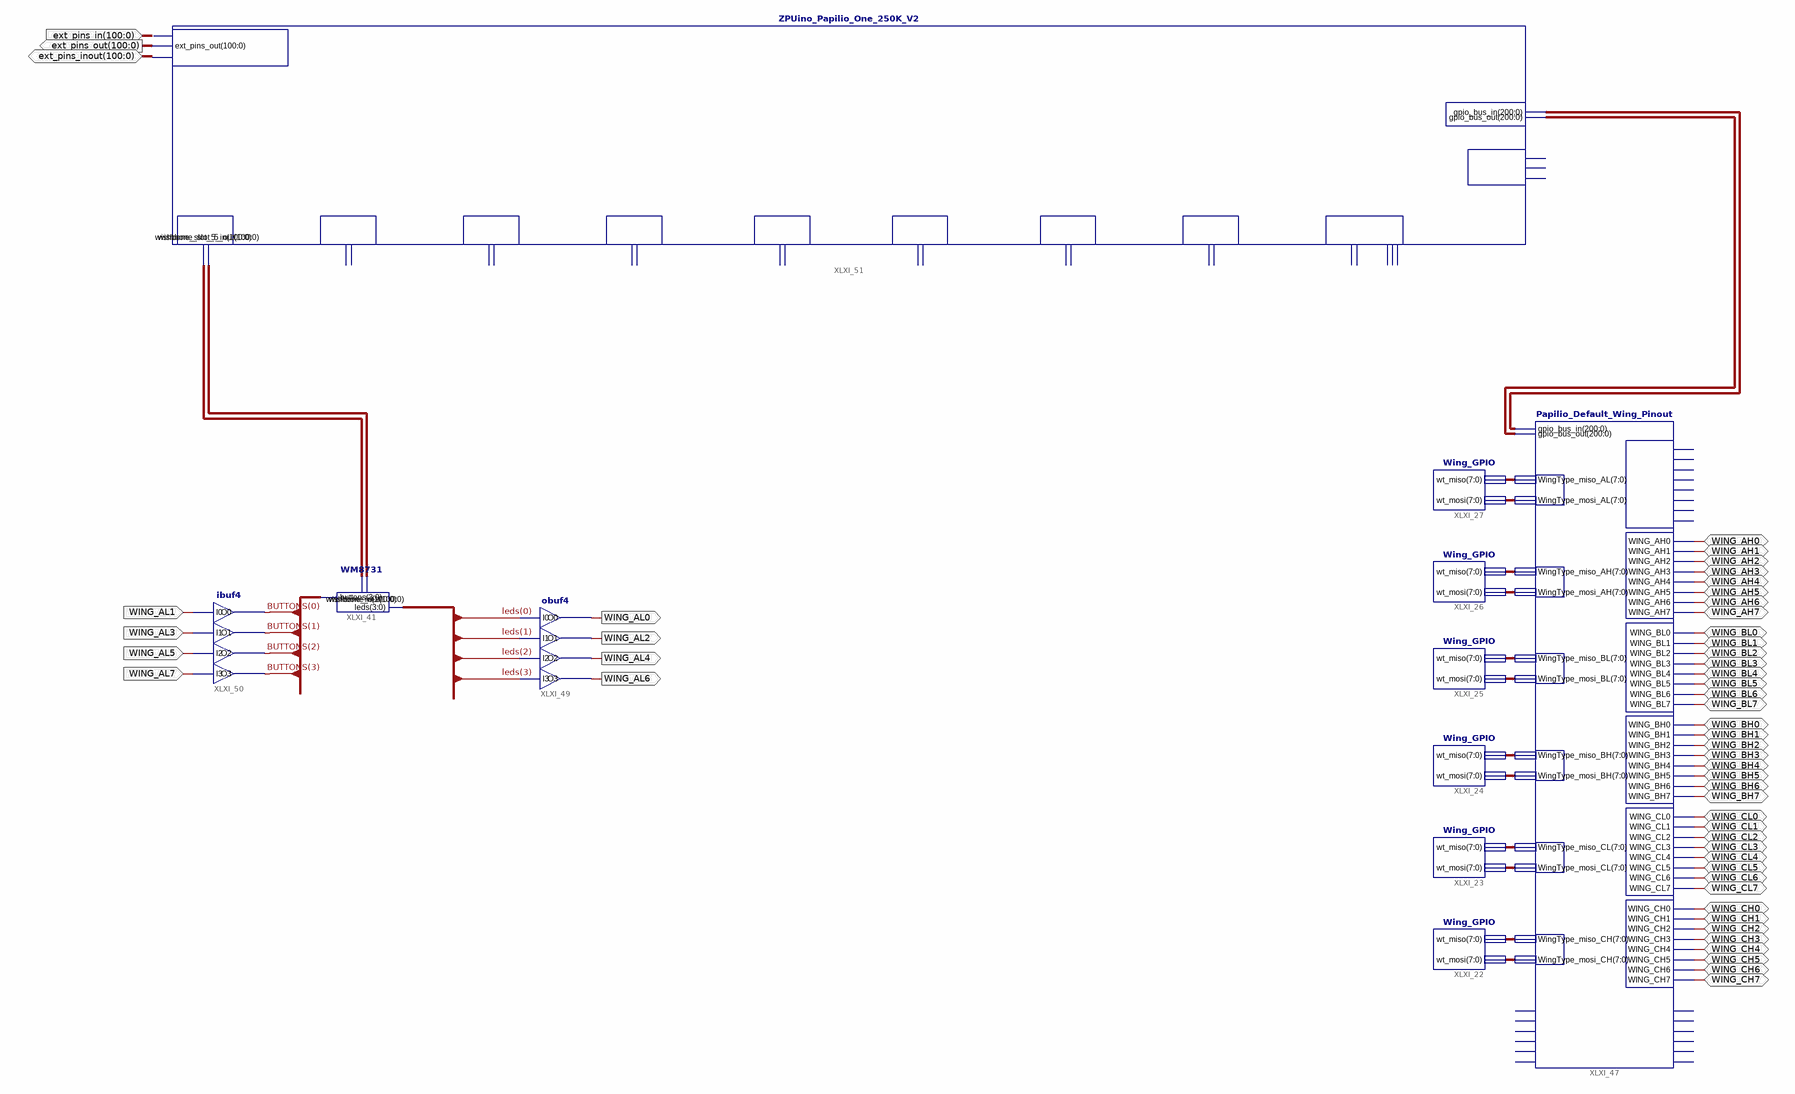
[diagram p0: schematic sheet 1]
// Xilinx ISE schematic Papilio_One_250K.sch (spartan3e) as structural Verilog: 11 symbols, 51 ports
module Papilio_One_250K (
  input  [100:0] ext_pins_in,
  input  WING_AL1,
  input  WING_AL3,
  input  WING_AL5,
  input  WING_AL7,
  inout  WING_AH0,
  inout  WING_AH1,
  inout  WING_AH2,
  inout  WING_AH3,
  inout  WING_AH4,
  inout  WING_AH5,
  inout  WING_AH6,
  inout  WING_AH7,
  inout  WING_BL0,
  inout  WING_BL1,
  inout  WING_BL2,
  inout  WING_BL3,
  inout  WING_BL4,
  inout  WING_BL5,
  inout  WING_BL6,
  inout  WING_BL7,
  inout  WING_BH0,
  inout  WING_BH1,
  inout  WING_BH2,
  inout  WING_BH3,
  inout  WING_BH4,
  inout  WING_BH5,
  inout  WING_BH6,
  inout  WING_BH7,
  inout  WING_CL0,
  inout  WING_CL1,
  inout  WING_CL2,
  inout  WING_CL3,
  inout  WING_CL4,
  inout  WING_CL5,
  inout  WING_CL6,
  inout  WING_CL7,
  inout  WING_CH0,
  inout  WING_CH1,
  inout  WING_CH2,
  inout  WING_CH3,
  inout  WING_CH4,
  inout  WING_CH5,
  inout  WING_CH6,
  inout  WING_CH7,
  inout  [100:0] ext_pins_inout,
  output [100:0] ext_pins_out,
  output WING_AL0,
  output WING_AL2,
  output WING_AL4,
  output WING_AL6
);

  wire [3:0] BUTTONS, leds;
  wire [7:0] XLXN_325, XLXN_326, XLXN_327, XLXN_328, XLXN_329, XLXN_330, XLXN_331, XLXN_332, XLXN_333,
       XLXN_334, XLXN_335, XLXN_336;
  wire [100:0] XLXN_487, XLXN_488;
  wire [200:0] XLXN_408, XLXN_409;

  Papilio_Default_Wing_Pinout XLXI_47 (
    .WING_AH0(WING_AH0), .WING_AH1(WING_AH1), .WING_AH2(WING_AH2), .WING_AH3(WING_AH3), .WING_AH4(WING_AH4),
    .WING_AH5(WING_AH5), .WING_AH6(WING_AH6), .WING_AH7(WING_AH7), .WING_BH0(WING_BH0), .WING_BH1(WING_BH1),
    .WING_BH2(WING_BH2), .WING_BH3(WING_BH3), .WING_BH4(WING_BH4), .WING_BH5(WING_BH5), .WING_BH6(WING_BH6),
    .WING_BH7(WING_BH7), .WING_BL0(WING_BL0), .WING_BL1(WING_BL1), .WING_BL2(WING_BL2), .WING_BL3(WING_BL3),
    .WING_BL4(WING_BL4), .WING_BL5(WING_BL5), .WING_BL6(WING_BL6), .WING_BL7(WING_BL7), .WING_CL0(WING_CL0),
    .WING_CL1(WING_CL1), .WING_CL2(WING_CL2), .WING_CL3(WING_CL3), .WING_CL4(WING_CL4), .WING_CL5(WING_CL5),
    .WING_CL6(WING_CL6), .WING_CL7(WING_CL7), .WING_CH0(WING_CH0), .WING_CH1(WING_CH1), .WING_CH2(WING_CH2),
    .WING_CH3(WING_CH3), .WING_CH4(WING_CH4), .WING_CH5(WING_CH5), .WING_CH6(WING_CH6), .WING_CH7(WING_CH7),
    .gpio_bus_out(XLXN_408), .gpio_bus_in(XLXN_409), .WingType_miso_BH(XLXN_329),
    .WingType_miso_BL(XLXN_331), .WingType_miso_AH(XLXN_333), .WingType_mosi_BL(XLXN_332),
    .WingType_mosi_BH(XLXN_330), .WingType_mosi_CL(XLXN_328), .WingType_mosi_AH(XLXN_334),
    .WingType_miso_CL(XLXN_327), .WingType_miso_CH(XLXN_325), .WingType_mosi_CH(XLXN_326),
    .WingType_mosi_AL(XLXN_336), .WingType_miso_AL(XLXN_335));  // open: WING_AL0, WING_AL1, WING_AL2, WING_AL3, WING_AL4, WING_AL5, WING_AL6, WING_AL7, Flex_Pin_out_0, Flex_Pin_out_1, Flex_Pin_out_2, Flex_Pin_out_3, Flex_Pin_out_4, Flex_Pin_out_5, Flex_Pin_in_0, Flex_Pin_in_1, Flex_Pin_in_2, Flex_Pin_in_3, Flex_Pin_in_4, Flex_Pin_in_5
  Wing_GPIO XLXI_22 (.wt_miso(XLXN_325), .wt_mosi(XLXN_326));
  Wing_GPIO XLXI_23 (.wt_miso(XLXN_327), .wt_mosi(XLXN_328));
  Wing_GPIO XLXI_24 (.wt_miso(XLXN_329), .wt_mosi(XLXN_330));
  Wing_GPIO XLXI_25 (.wt_miso(XLXN_331), .wt_mosi(XLXN_332));
  Wing_GPIO XLXI_26 (.wt_miso(XLXN_333), .wt_mosi(XLXN_334));
  Wing_GPIO XLXI_27 (.wt_miso(XLXN_335), .wt_mosi(XLXN_336));
  WM8731 XLXI_41 (.buttons(BUTTONS), .leds(leds), .wishbone_in(XLXN_487), .wishbone_out(XLXN_488));
  obuf4 XLXI_49 (
    .I0(leds[0]), .I1(leds[1]), .I2(leds[2]), .I3(leds[3]), .O0(WING_AL0), .O1(WING_AL2), .O2(WING_AL4),
    .O3(WING_AL6));
  ibuf4 XLXI_50 (
    .I0(WING_AL1), .I1(WING_AL3), .I2(WING_AL5), .I3(WING_AL7), .O0(BUTTONS[0]), .O1(BUTTONS[1]),
    .O2(BUTTONS[2]), .O3(BUTTONS[3]));
  ZPUino_Papilio_One_250K_V2 XLXI_51 (
    .ext_pins_in(ext_pins_in), .ext_pins_out(ext_pins_out), .ext_pins_inout(ext_pins_inout),
    .gpio_bus_out(XLXN_408), .gpio_bus_in(XLXN_409), .wishbone_slot_5_out(XLXN_488),
    .wishbone_slot_5_in(XLXN_487));  // open: clk_96Mhz, clk_1Mhz, clk_osc_32Mhz, wishbone_slot_6_in, wishbone_slot_6_out, wishbone_slot_8_in, wishbone_slot_8_out, wishbone_slot_9_in, wishbone_slot_9_out, wishbone_slot_10_in, wishbone_slot_10_out, wishbone_slot_11_in, wishbone_slot_11_out, wishbone_slot_12_in, wishbone_slot_12_out, wishbone_slot_13_in, wishbone_slot_13_out, wishbone_slot_14_in, wishbone_slot_14_out, wishbone_slot_video_in, wishbone_slot_video_out, vgaclkout
endmodule
